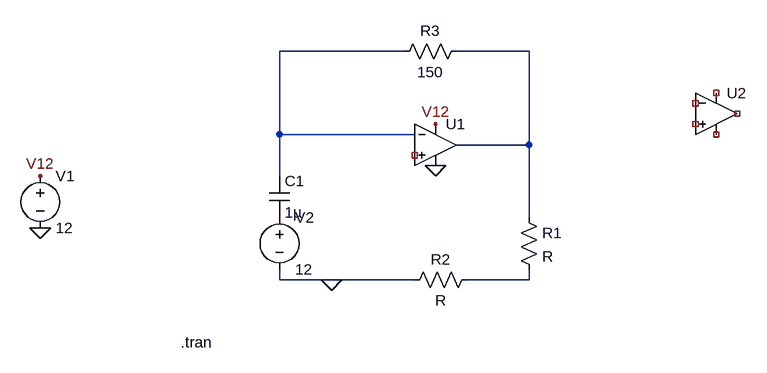
[diagram p0: schematic Controller.asc]
Controller.asc, the LTspice schematic file:
Version 4
SHEET 1 880 680
WIRE 352 96 160 96
WIRE 544 96 432 96
WIRE 160 224 160 96
WIRE 368 224 160 224
WIRE 544 240 544 96
WIRE 544 240 432 240
WIRE 160 288 160 224
WIRE 544 352 544 240
WIRE 160 448 160 432
WIRE 240 448 160 448
WIRE 368 448 240 448
WIRE 544 448 544 432
WIRE 544 448 448 448
FLAG -208 368 0
FLAG -208 288 V12
FLAG 400 208 V12
FLAG 400 272 0
FLAG 240 448 0
SYMBOL OpAmps/UniversalOpamp 400 240 R0
SYMATTR InstName U1
SYMBOL res 528 336 R0
SYMATTR InstName R1
SYMBOL res 464 432 R90
WINDOW 0 0 56 VBottom 2
WINDOW 3 32 56 VTop 2
SYMATTR InstName R2
SYMBOL res 448 80 R90
WINDOW 0 0 56 VBottom 2
WINDOW 3 32 56 VTop 2
SYMATTR InstName R3
SYMATTR Value 150
SYMBOL cap 144 288 R0
SYMATTR InstName C1
SYMATTR Value 1µ
SYMBOL voltage -208 272 R0
SYMATTR InstName V1
SYMATTR Value 12
SYMBOL OpAmps/UniversalOpamp 832 192 R0
SYMATTR InstName U2
SYMBOL voltage 160 336 R0
SYMATTR InstName V2
SYMATTR Value 12
TEXT 8 544 Left 2 !.tran

The netlist it stands for:
* Controller.asc
XU1 NC_01 N001 V12 0 N002 level1 Avol=1Meg GBW=10Meg Vos=0 En=0 Enk=0 In=0 Ink=0 Rin=500Meg  ; pins In+ In- V+ V- OUT
R1 N002 N003 R
R2 N003 0 R
R3 N002 N001 150
C1 N001 P001 1µ
V1 V12 0 12
XU2 NC_02 NC_03 NC_04 NC_05 NC_06 level1 Avol=1Meg GBW=10Meg Vos=0 En=0 Enk=0 In=0 Ink=0 Rin=500Meg  ; pins In+ In- V+ V- OUT
V2 P001 0 12
.tran
.lib UniversalOpAmp1.lib
.backanno
.end